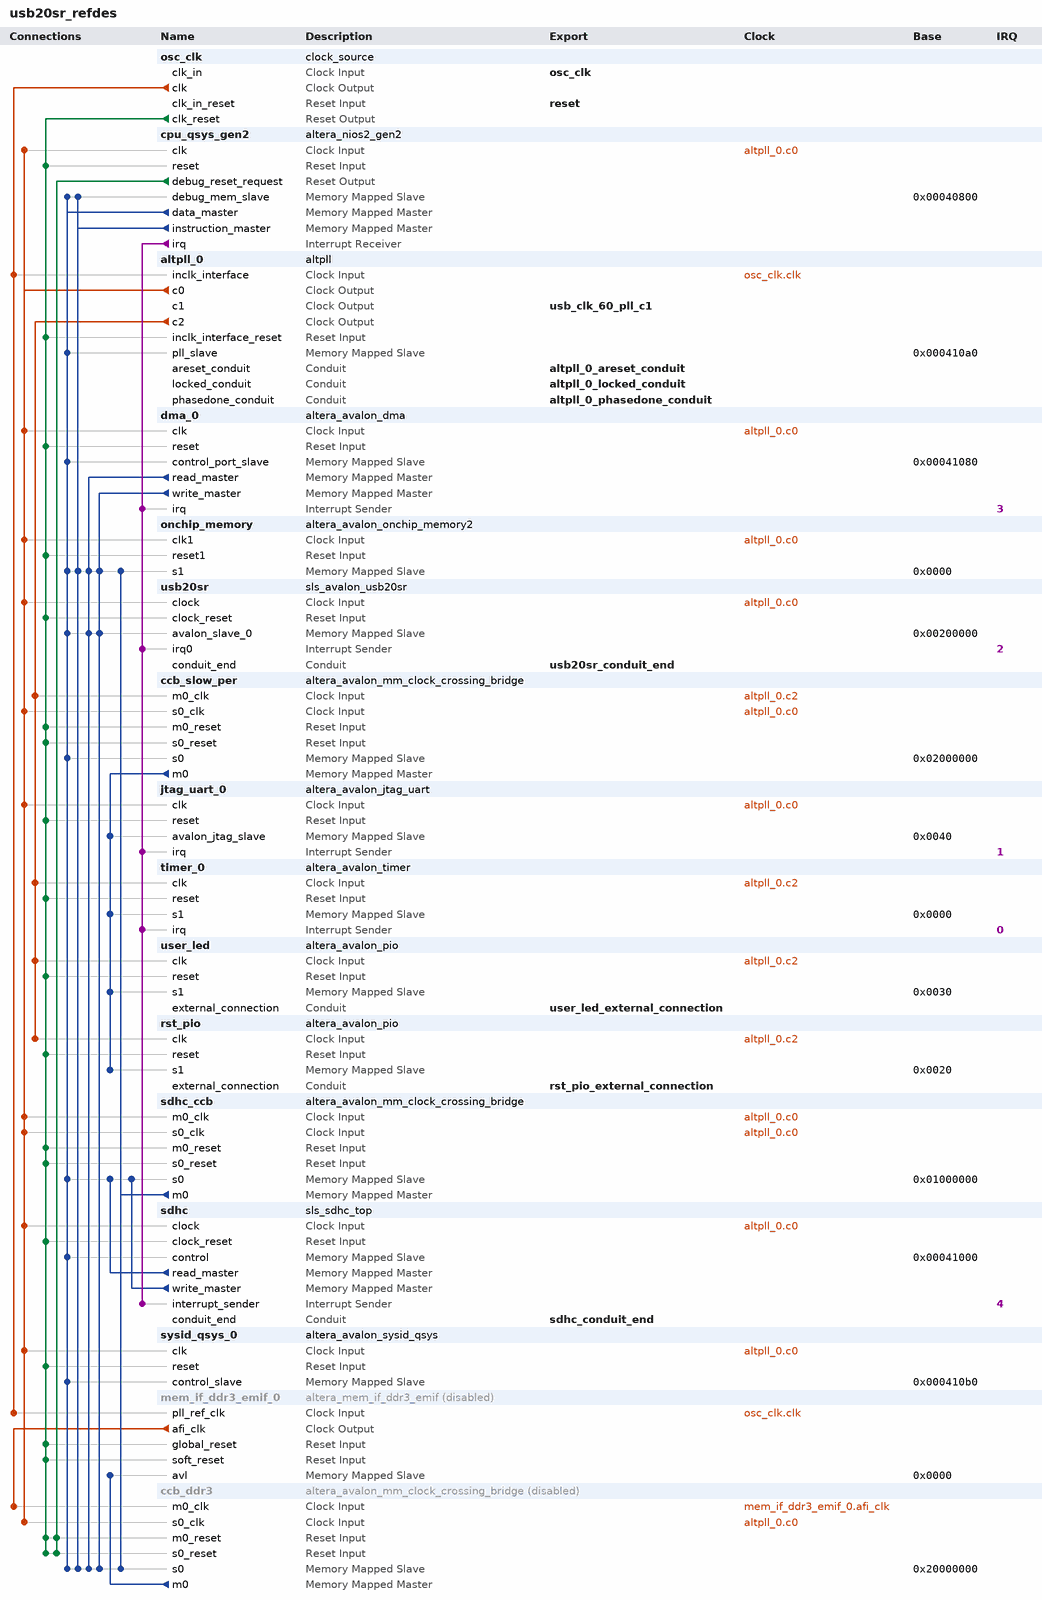
[diagram p0: system contents]
# Platform Designer (Qsys) system usb20sr_refdes, MAX 10 10M50DAF484C6GES
# Parameters at their usual value, and those the tool derives, are not listed.
package require -exact qsys 15.0
create_system usb20sr_refdes
set_project_property DEVICE_FAMILY {MAX 10}
set_project_property DEVICE 10M50DAF484C6GES

add_instance osc_clk clock_source 15.0
set_instance_parameter_value osc_clk clockFrequency 50000000

add_instance cpu_qsys_gen2 altera_nios2_gen2 15.0
set_instance_parameter_value cpu_qsys_gen2 dcache_size 8192
set_instance_parameter_value cpu_qsys_gen2 exceptionSlave onchip_memory.s1
set_instance_parameter_value cpu_qsys_gen2 icache_size 2048
set_instance_parameter_value cpu_qsys_gen2 impl Fast
set_instance_parameter_value cpu_qsys_gen2 resetSlave onchip_memory.s1

add_instance altpll_0 altpll 15.0
set_instance_parameter_value altpll_0 CLK0_DIVIDE_BY 1
set_instance_parameter_value altpll_0 CLK0_MULTIPLY_BY 2
set_instance_parameter_value altpll_0 CLK1_DIVIDE_BY 5
set_instance_parameter_value altpll_0 CLK1_DUTY_CYCLE 50
set_instance_parameter_value altpll_0 CLK1_MULTIPLY_BY 6
set_instance_parameter_value altpll_0 CLK1_PHASE_SHIFT 0
set_instance_parameter_value altpll_0 CLK2_DIVIDE_BY 25
set_instance_parameter_value altpll_0 CLK2_DUTY_CYCLE 50
set_instance_parameter_value altpll_0 CLK2_MULTIPLY_BY 24
set_instance_parameter_value altpll_0 CLK2_PHASE_SHIFT 0
set_instance_parameter_value altpll_0 INCLK0_INPUT_FREQUENCY 20000
set_instance_parameter_value altpll_0 PORT_ARESET PORT_USED
set_instance_parameter_value altpll_0 PORT_LOCKED PORT_USED
set_instance_parameter_value altpll_0 PORT_clk1 PORT_USED
set_instance_parameter_value altpll_0 PORT_clk2 PORT_USED
set_instance_parameter_value altpll_0 PORT_clk3 PORT_UNUSED

add_instance dma_0 altera_avalon_dma 15.0
set_instance_parameter_value dma_0 allowByteTransactions true
set_instance_parameter_value dma_0 allowDoubleWordTransactions true
set_instance_parameter_value dma_0 allowHalfWordTransactions true
set_instance_parameter_value dma_0 allowQuadWordTransactions true
set_instance_parameter_value dma_0 burstEnable false
set_instance_parameter_value dma_0 fifoDepth 32
set_instance_parameter_value dma_0 maxBurstSize 128
set_instance_parameter_value dma_0 minimumDmaTransactionRegisterWidth 13

add_instance onchip_memory altera_avalon_onchip_memory2 15.0
set_instance_parameter_value onchip_memory dataWidth 32
set_instance_parameter_value onchip_memory dualPort false
set_instance_parameter_value onchip_memory initMemContent true
set_instance_parameter_value onchip_memory initializationFileName onchip_memory
set_instance_parameter_value onchip_memory memorySize 133120

add_instance usb20sr sls_avalon_usb20sr 1.4
set_instance_parameter_value usb20sr Enum_data_file Enum_ram.hex
set_instance_parameter_value usb20sr IN_DEPTH 512
set_instance_parameter_value usb20sr Interface_sel 0
set_instance_parameter_value usb20sr OUT_DEPTH 512
set_instance_parameter_value usb20sr Simulation 0

add_instance ccb_slow_per altera_avalon_mm_clock_crossing_bridge 15.0
set_instance_parameter_value ccb_slow_per ADDRESS_WIDTH 7
set_instance_parameter_value ccb_slow_per COMMAND_FIFO_DEPTH 8
set_instance_parameter_value ccb_slow_per DATA_WIDTH 32
set_instance_parameter_value ccb_slow_per MASTER_SYNC_DEPTH 3
set_instance_parameter_value ccb_slow_per MAX_BURST_SIZE 1
set_instance_parameter_value ccb_slow_per RESPONSE_FIFO_DEPTH 32
set_instance_parameter_value ccb_slow_per SLAVE_SYNC_DEPTH 3
set_instance_parameter_value ccb_slow_per USE_AUTO_ADDRESS_WIDTH 0

add_instance jtag_uart_0 altera_avalon_jtag_uart 15.0
set_instance_parameter_value jtag_uart_0 simInteractiveOptions INTERACTIVE_ASCII_OUTPUT

add_instance timer_0 altera_avalon_timer 15.0
set_instance_parameter_value timer_0 period 1
set_instance_parameter_value timer_0 periodUnits MSEC

add_instance user_led altera_avalon_pio 15.0
set_instance_parameter_value user_led direction Output
set_instance_parameter_value user_led width 8

add_instance rst_pio altera_avalon_pio 15.0
set_instance_parameter_value rst_pio direction Output
set_instance_parameter_value rst_pio width 1

add_instance sdhc_ccb altera_avalon_mm_clock_crossing_bridge 15.0
set_instance_parameter_value sdhc_ccb ADDRESS_WIDTH 30
set_instance_parameter_value sdhc_ccb COMMAND_FIFO_DEPTH 4
set_instance_parameter_value sdhc_ccb DATA_WIDTH 32
set_instance_parameter_value sdhc_ccb MASTER_SYNC_DEPTH 2
set_instance_parameter_value sdhc_ccb MAX_BURST_SIZE 1
set_instance_parameter_value sdhc_ccb RESPONSE_FIFO_DEPTH 4
set_instance_parameter_value sdhc_ccb SLAVE_SYNC_DEPTH 2
set_instance_parameter_value sdhc_ccb USE_AUTO_ADDRESS_WIDTH 1

add_instance sdhc sls_sdhc_top 3.0
set_instance_parameter_value sdhc DATA_INTERFACE SDR
set_instance_parameter_value sdhc PWR_CYC_WIDTH_IN_uS 100
set_instance_parameter_value sdhc PWR_GD_TIME_IN_uS 100
set_instance_parameter_value sdhc SD_EMMC_SEL SD
set_instance_parameter_value sdhc SD_FEEDBACK_CLK true
set_instance_parameter_value sdhc SYS_FREQ_HZ 100000000

add_instance sysid_qsys_0 altera_avalon_sysid_qsys 15.0
set_instance_parameter_value sysid_qsys_0 id 233612565

add_instance mem_if_ddr3_emif_0 altera_mem_if_ddr3_emif 15.0
set_instance_property mem_if_ddr3_emif_0 ENABLED false
set_instance_parameter_value mem_if_ddr3_emif_0 AVL_MAX_SIZE 4
set_instance_parameter_value mem_if_ddr3_emif_0 CALIBRATION_MODE Skip
set_instance_parameter_value mem_if_ddr3_emif_0 CPORT_TYPE_PORT Bidirectional,Bidirectional,Bidirectional,Bidirectional,Bidirectional,Bidirectional
set_instance_parameter_value mem_if_ddr3_emif_0 EXPORT_AFI_HALF_CLK false
set_instance_parameter_value mem_if_ddr3_emif_0 HARD_EMIF false
set_instance_parameter_value mem_if_ddr3_emif_0 MEM_BANKADDR_WIDTH 3
set_instance_parameter_value mem_if_ddr3_emif_0 MEM_CLK_FREQ 300.0
set_instance_parameter_value mem_if_ddr3_emif_0 MEM_CLK_FREQ_MAX 800.0
set_instance_parameter_value mem_if_ddr3_emif_0 MEM_COL_ADDR_WIDTH 10
set_instance_parameter_value mem_if_ddr3_emif_0 MEM_DQ_WIDTH 16
set_instance_parameter_value mem_if_ddr3_emif_0 MEM_DRV_STR RZQ/6
set_instance_parameter_value mem_if_ddr3_emif_0 MEM_FORMAT DISCRETE
set_instance_parameter_value mem_if_ddr3_emif_0 MEM_ROW_ADDR_WIDTH 15
set_instance_parameter_value mem_if_ddr3_emif_0 MEM_TCL 7
set_instance_parameter_value mem_if_ddr3_emif_0 MEM_TFAW_NS 45.0
set_instance_parameter_value mem_if_ddr3_emif_0 MEM_TRAS_NS 35.0
set_instance_parameter_value mem_if_ddr3_emif_0 MEM_TRCD_NS 13.75
set_instance_parameter_value mem_if_ddr3_emif_0 MEM_TRFC_NS 260.0
set_instance_parameter_value mem_if_ddr3_emif_0 MEM_TRP_NS 13.75
set_instance_parameter_value mem_if_ddr3_emif_0 MEM_TRRD_NS 7.5
set_instance_parameter_value mem_if_ddr3_emif_0 MEM_TRTP_NS 7.5
set_instance_parameter_value mem_if_ddr3_emif_0 MEM_TWTR 6
set_instance_parameter_value mem_if_ddr3_emif_0 MEM_VENDOR Micron
set_instance_parameter_value mem_if_ddr3_emif_0 MEM_WTCL 6
set_instance_parameter_value mem_if_ddr3_emif_0 PLL_LOCATION Top_Bottom
set_instance_parameter_value mem_if_ddr3_emif_0 POWER_OF_TWO_BUS true
set_instance_parameter_value mem_if_ddr3_emif_0 PRIORITY_PORT 1,1,1,1,1,1
set_instance_parameter_value mem_if_ddr3_emif_0 RATE Half
set_instance_parameter_value mem_if_ddr3_emif_0 REF_CLK_FREQ 50.0
set_instance_parameter_value mem_if_ddr3_emif_0 SPEED_GRADE 6
set_instance_parameter_value mem_if_ddr3_emif_0 TIMING_BOARD_AC_SKEW 0.017068
set_instance_parameter_value mem_if_ddr3_emif_0 TIMING_BOARD_AC_TO_CK_SKEW -1.32E-4
set_instance_parameter_value mem_if_ddr3_emif_0 TIMING_BOARD_DQ_TO_DQS_SKEW -6.02E-4
set_instance_parameter_value mem_if_ddr3_emif_0 TIMING_BOARD_MAX_CK_DELAY 0.183886
set_instance_parameter_value mem_if_ddr3_emif_0 TIMING_BOARD_MAX_DQS_DELAY 0.181597
set_instance_parameter_value mem_if_ddr3_emif_0 TIMING_BOARD_SKEW_BETWEEN_DQS 0.005112
set_instance_parameter_value mem_if_ddr3_emif_0 TIMING_BOARD_SKEW_CKDQS_DIMM_MAX 0.007401
set_instance_parameter_value mem_if_ddr3_emif_0 TIMING_BOARD_SKEW_CKDQS_DIMM_MIN 0.002282
set_instance_parameter_value mem_if_ddr3_emif_0 TIMING_BOARD_SKEW_WITHIN_DQS 0.008422
set_instance_parameter_value mem_if_ddr3_emif_0 TIMING_TDH 55
set_instance_parameter_value mem_if_ddr3_emif_0 TIMING_TDQSCK 225
set_instance_parameter_value mem_if_ddr3_emif_0 TIMING_TDQSQ 125
set_instance_parameter_value mem_if_ddr3_emif_0 TIMING_TDQSS 0.25
set_instance_parameter_value mem_if_ddr3_emif_0 TIMING_TDS 55
set_instance_parameter_value mem_if_ddr3_emif_0 TIMING_TDSH 0.2
set_instance_parameter_value mem_if_ddr3_emif_0 TIMING_TDSS 0.2
set_instance_parameter_value mem_if_ddr3_emif_0 TIMING_TIH 130
set_instance_parameter_value mem_if_ddr3_emif_0 TIMING_TIS 185
set_instance_parameter_value mem_if_ddr3_emif_0 TIMING_TQSH 0.4
set_instance_parameter_value mem_if_ddr3_emif_0 USER_DEBUG_LEVEL 1

add_instance ccb_ddr3 altera_avalon_mm_clock_crossing_bridge 15.0
set_instance_property ccb_ddr3 ENABLED false
set_instance_parameter_value ccb_ddr3 ADDRESS_WIDTH 30
set_instance_parameter_value ccb_ddr3 COMMAND_FIFO_DEPTH 4
set_instance_parameter_value ccb_ddr3 DATA_WIDTH 32
set_instance_parameter_value ccb_ddr3 MASTER_SYNC_DEPTH 2
set_instance_parameter_value ccb_ddr3 MAX_BURST_SIZE 1
set_instance_parameter_value ccb_ddr3 RESPONSE_FIFO_DEPTH 4
set_instance_parameter_value ccb_ddr3 SLAVE_SYNC_DEPTH 2
set_instance_parameter_value ccb_ddr3 USE_AUTO_ADDRESS_WIDTH 1

# connections
add_connection altpll_0.c0 ccb_ddr3.s0_clk clock
add_connection altpll_0.c0 ccb_slow_per.s0_clk clock
add_connection altpll_0.c0 cpu_qsys_gen2.clk clock
add_connection altpll_0.c0 dma_0.clk clock
add_connection altpll_0.c0 jtag_uart_0.clk clock
add_connection altpll_0.c0 onchip_memory.clk1 clock
add_connection altpll_0.c0 sdhc.clock clock
add_connection altpll_0.c0 sdhc_ccb.m0_clk clock
add_connection altpll_0.c0 sdhc_ccb.s0_clk clock
add_connection altpll_0.c0 sysid_qsys_0.clk clock
add_connection altpll_0.c0 usb20sr.clock clock
add_connection altpll_0.c2 ccb_slow_per.m0_clk clock
add_connection altpll_0.c2 rst_pio.clk clock
add_connection altpll_0.c2 timer_0.clk clock
add_connection altpll_0.c2 user_led.clk clock
add_connection mem_if_ddr3_emif_0.afi_clk ccb_ddr3.m0_clk clock
add_connection osc_clk.clk altpll_0.inclk_interface clock
add_connection osc_clk.clk mem_if_ddr3_emif_0.pll_ref_clk clock
add_connection cpu_qsys_gen2.debug_reset_request ccb_ddr3.m0_reset reset
add_connection cpu_qsys_gen2.debug_reset_request ccb_ddr3.s0_reset reset
add_connection osc_clk.clk_reset altpll_0.inclk_interface_reset reset
add_connection osc_clk.clk_reset ccb_ddr3.m0_reset reset
add_connection osc_clk.clk_reset ccb_ddr3.s0_reset reset
add_connection osc_clk.clk_reset ccb_slow_per.m0_reset reset
add_connection osc_clk.clk_reset ccb_slow_per.s0_reset reset
add_connection osc_clk.clk_reset cpu_qsys_gen2.reset reset
add_connection osc_clk.clk_reset dma_0.reset reset
add_connection osc_clk.clk_reset jtag_uart_0.reset reset
add_connection osc_clk.clk_reset mem_if_ddr3_emif_0.global_reset reset
add_connection osc_clk.clk_reset mem_if_ddr3_emif_0.soft_reset reset
add_connection osc_clk.clk_reset onchip_memory.reset1 reset
add_connection osc_clk.clk_reset rst_pio.reset reset
add_connection osc_clk.clk_reset sdhc.clock_reset reset
add_connection osc_clk.clk_reset sdhc_ccb.m0_reset reset
add_connection osc_clk.clk_reset sdhc_ccb.s0_reset reset
add_connection osc_clk.clk_reset sysid_qsys_0.reset reset
add_connection osc_clk.clk_reset timer_0.reset reset
add_connection osc_clk.clk_reset usb20sr.clock_reset reset
add_connection osc_clk.clk_reset user_led.reset reset
add_connection ccb_ddr3.m0 mem_if_ddr3_emif_0.avl avalon
set_connection_parameter_value ccb_ddr3.m0/mem_if_ddr3_emif_0.avl baseAddress 0x0000
add_connection ccb_slow_per.m0 jtag_uart_0.avalon_jtag_slave avalon
set_connection_parameter_value ccb_slow_per.m0/jtag_uart_0.avalon_jtag_slave baseAddress 0x0040
add_connection ccb_slow_per.m0 rst_pio.s1 avalon
set_connection_parameter_value ccb_slow_per.m0/rst_pio.s1 baseAddress 0x0020
add_connection ccb_slow_per.m0 timer_0.s1 avalon
set_connection_parameter_value ccb_slow_per.m0/timer_0.s1 baseAddress 0x0000
add_connection ccb_slow_per.m0 user_led.s1 avalon
set_connection_parameter_value ccb_slow_per.m0/user_led.s1 baseAddress 0x0030
add_connection cpu_qsys_gen2.data_master altpll_0.pll_slave avalon
set_connection_parameter_value cpu_qsys_gen2.data_master/altpll_0.pll_slave baseAddress 0x000410a0
add_connection cpu_qsys_gen2.data_master ccb_ddr3.s0 avalon
set_connection_parameter_value cpu_qsys_gen2.data_master/ccb_ddr3.s0 baseAddress 0x20000000
add_connection cpu_qsys_gen2.data_master ccb_slow_per.s0 avalon
set_connection_parameter_value cpu_qsys_gen2.data_master/ccb_slow_per.s0 baseAddress 0x02000000
add_connection cpu_qsys_gen2.data_master cpu_qsys_gen2.debug_mem_slave avalon
set_connection_parameter_value cpu_qsys_gen2.data_master/cpu_qsys_gen2.debug_mem_slave baseAddress 0x00040800
add_connection cpu_qsys_gen2.data_master dma_0.control_port_slave avalon
set_connection_parameter_value cpu_qsys_gen2.data_master/dma_0.control_port_slave baseAddress 0x00041080
add_connection cpu_qsys_gen2.data_master onchip_memory.s1 avalon
set_connection_parameter_value cpu_qsys_gen2.data_master/onchip_memory.s1 baseAddress 0x0000
add_connection cpu_qsys_gen2.data_master sdhc.control avalon
set_connection_parameter_value cpu_qsys_gen2.data_master/sdhc.control baseAddress 0x00041000
add_connection cpu_qsys_gen2.data_master sdhc_ccb.s0 avalon
set_connection_parameter_value cpu_qsys_gen2.data_master/sdhc_ccb.s0 baseAddress 0x01000000
add_connection cpu_qsys_gen2.data_master sysid_qsys_0.control_slave avalon
set_connection_parameter_value cpu_qsys_gen2.data_master/sysid_qsys_0.control_slave baseAddress 0x000410b0
add_connection cpu_qsys_gen2.data_master usb20sr.avalon_slave_0 avalon
set_connection_parameter_value cpu_qsys_gen2.data_master/usb20sr.avalon_slave_0 baseAddress 0x00200000
add_connection cpu_qsys_gen2.instruction_master ccb_ddr3.s0 avalon
set_connection_parameter_value cpu_qsys_gen2.instruction_master/ccb_ddr3.s0 baseAddress 0x20000000
add_connection cpu_qsys_gen2.instruction_master cpu_qsys_gen2.debug_mem_slave avalon
set_connection_parameter_value cpu_qsys_gen2.instruction_master/cpu_qsys_gen2.debug_mem_slave baseAddress 0x00040800
add_connection cpu_qsys_gen2.instruction_master onchip_memory.s1 avalon
set_connection_parameter_value cpu_qsys_gen2.instruction_master/onchip_memory.s1 baseAddress 0x0000
add_connection dma_0.read_master ccb_ddr3.s0 avalon
set_connection_parameter_value dma_0.read_master/ccb_ddr3.s0 baseAddress 0x20000000
add_connection dma_0.read_master onchip_memory.s1 avalon
set_connection_parameter_value dma_0.read_master/onchip_memory.s1 baseAddress 0x0000
add_connection dma_0.read_master usb20sr.avalon_slave_0 avalon
set_connection_parameter_value dma_0.read_master/usb20sr.avalon_slave_0 baseAddress 0x00200000
add_connection dma_0.write_master ccb_ddr3.s0 avalon
set_connection_parameter_value dma_0.write_master/ccb_ddr3.s0 baseAddress 0x20000000
add_connection dma_0.write_master onchip_memory.s1 avalon
set_connection_parameter_value dma_0.write_master/onchip_memory.s1 baseAddress 0x0000
add_connection dma_0.write_master usb20sr.avalon_slave_0 avalon
set_connection_parameter_value dma_0.write_master/usb20sr.avalon_slave_0 baseAddress 0x00200000
add_connection sdhc.read_master sdhc_ccb.s0 avalon
set_connection_parameter_value sdhc.read_master/sdhc_ccb.s0 baseAddress 0x01000000
add_connection sdhc.write_master sdhc_ccb.s0 avalon
set_connection_parameter_value sdhc.write_master/sdhc_ccb.s0 baseAddress 0x01000000
add_connection sdhc_ccb.m0 ccb_ddr3.s0 avalon
set_connection_parameter_value sdhc_ccb.m0/ccb_ddr3.s0 baseAddress 0x20000000
add_connection sdhc_ccb.m0 onchip_memory.s1 avalon
set_connection_parameter_value sdhc_ccb.m0/onchip_memory.s1 baseAddress 0x0000
add_connection cpu_qsys_gen2.irq dma_0.irq interrupt
set_connection_parameter_value cpu_qsys_gen2.irq/dma_0.irq irqNumber 3
add_connection cpu_qsys_gen2.irq jtag_uart_0.irq interrupt
set_connection_parameter_value cpu_qsys_gen2.irq/jtag_uart_0.irq irqNumber 1
add_connection cpu_qsys_gen2.irq sdhc.interrupt_sender interrupt
set_connection_parameter_value cpu_qsys_gen2.irq/sdhc.interrupt_sender irqNumber 4
add_connection cpu_qsys_gen2.irq timer_0.irq interrupt
set_connection_parameter_value cpu_qsys_gen2.irq/timer_0.irq irqNumber 0
add_connection cpu_qsys_gen2.irq usb20sr.irq0 interrupt
set_connection_parameter_value cpu_qsys_gen2.irq/usb20sr.irq0 irqNumber 2

# exported interfaces
add_interface altpll_0_areset_conduit conduit end
set_interface_property altpll_0_areset_conduit EXPORT_OF altpll_0.areset_conduit
add_interface altpll_0_locked_conduit conduit end
set_interface_property altpll_0_locked_conduit EXPORT_OF altpll_0.locked_conduit
add_interface altpll_0_phasedone_conduit conduit end
set_interface_property altpll_0_phasedone_conduit EXPORT_OF altpll_0.phasedone_conduit
add_interface osc_clk clock sink
set_interface_property osc_clk EXPORT_OF osc_clk.clk_in
add_interface reset reset sink
set_interface_property reset EXPORT_OF osc_clk.clk_in_reset
add_interface rst_pio_external_connection conduit end
set_interface_property rst_pio_external_connection EXPORT_OF rst_pio.external_connection
add_interface sdhc_conduit_end conduit end
set_interface_property sdhc_conduit_end EXPORT_OF sdhc.conduit_end
add_interface usb20sr_conduit_end conduit end
set_interface_property usb20sr_conduit_end EXPORT_OF usb20sr.conduit_end
add_interface usb_clk_60_pll_c1 clock source
set_interface_property usb_clk_60_pll_c1 EXPORT_OF altpll_0.c1
add_interface user_led_external_connection conduit end
set_interface_property user_led_external_connection EXPORT_OF user_led.external_connection

set_interconnect_requirement {$system} qsys_mm.clockCrossingAdapter HANDSHAKE
set_interconnect_requirement {$system} qsys_mm.maxAdditionalLatency 0

save_system usb20sr_refdes.qsys
